# EAGLE design counter (EAGLE 5.11)
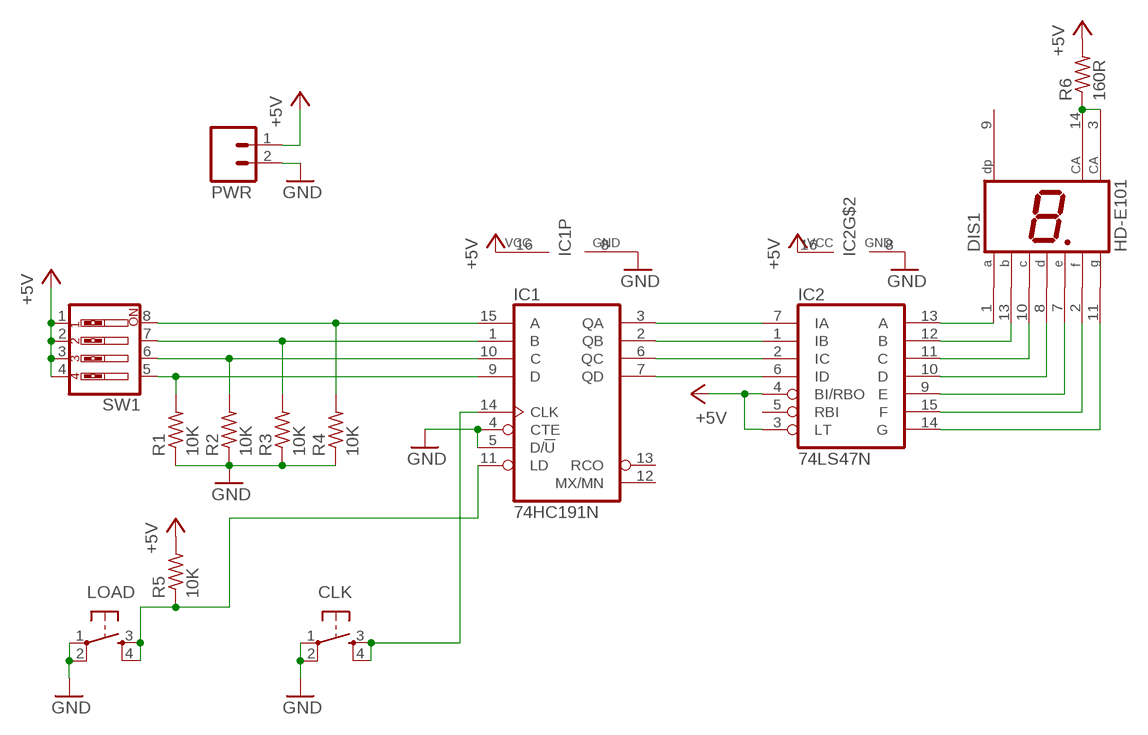
[diagram p0: schematic, sheet 1]

## Parts
CLK  TAC_SWITCHPTH  [TACTILE-PTH]
DIS1  HD-E101  [HDSP-I]
IC1  74HC191N  [DIL16]
IC2  74LS47N  [DIL16]
LOAD  TAC_SWITCHPTH  [TACTILE-PTH]
PWR  M02PTH3  [1X02_LONGPADS]
R1  10K  R-US_0204/7  [0204/7]
R2  10K  R-US_0204/7  [0204/7]
R3  10K  R-US_0204/7  [0204/7]
R4  10K  R-US_0204/7  [0204/7]
R5  10K  R-US_0204/7  [0204/7]
R6  160R  R-US_0204/7  [0204/7]
SW1  SW_DIP-4  [EDG-04]

## Nets
+5V: IC1.16(VCC) IC2.3(LT) IC2.4(BI/RBO) IC2.16(VCC) PWR.1 R5.2 R6.2 SW1.1 SW1.2 SW1.3 SW1.4
GND: CLK.1 CLK.2 IC1.4(CTE) IC1.5(D/!U) IC1.8(GND) IC2.8(GND) LOAD.1 LOAD.2 PWR.2 R1.1 R2.1 R3.1 R4.1
N$1: IC1.9(D) R1.2 SW1.5
N$2: IC1.10(C) R2.2 SW1.6
N$3: IC1.1(B) R3.2 SW1.7
N$4: IC1.15(A) R4.2 SW1.8
N$5: IC1.11(LD) LOAD.3 LOAD.4 R5.1
N$6: IC1.3(QA) IC2.7(IA)
N$7: CLK.3 CLK.4 IC1.14(CLK)
N$8: IC1.2(QB) IC2.1(IB)
N$9: IC1.6(QC) IC2.2(IC)
N$10: IC1.7(QD) IC2.6(ID)
N$11: DIS1.1(A) IC2.13(A)
N$12: DIS1.13(B) IC2.12(B)
N$13: DIS1.10(C) IC2.11(C)
N$14: DIS1.8(D) IC2.10(D)
N$15: DIS1.7(E) IC2.9(E)
N$16: DIS1.2(F) IC2.15(F)
N$17: DIS1.11(G) IC2.14(G)
N$18: DIS1.3(CA) DIS1.14(CA) R6.1
Unconnected: DIS1.9(DP) IC1.12(MX/MN) IC1.13(RCO) IC2.5(RBI)

## Library data of the parts
CLK LOAD = SparkFun:TAC_SWITCH: Momentary Switch Button commonly used for reset or general input. Spark Fun Electronics SKU : COM-00097
DIS1 = display-hp:HD-E101: LED DISPLAY 1-character 7 segment, decimal point right; OC_FARNELL: unknown; OC_NEWARK: unknown
IC1 = 74xx-eu:74*191: Synchronous UP/DOWN COUNTER
IC2 = 74xx-eu:74*47: BCD to seven segment DECODER/DRIVER Source: http://www.ee.washington.edu/stores/DataSheets/74ls/74ls47.pdf
PWR = SparkFun:M02: Header 2 Standard 2-pin 0.1" header. Use with straight break away headers (SKU : PRT-00116), right angle break away headers (PRT-00553), swiss pins (PRT-00743), machine pins (PRT-00117), and female headers (PRT-00115). Molex polarized connector foot print use with SKU : PRT-08233 with associated crimp pins and housings.
R1-R6 = adafruit:R-US_: RESISTOR, American symbol
SW1 = special:SW_DIP-4: DIP SWITCH

## Board
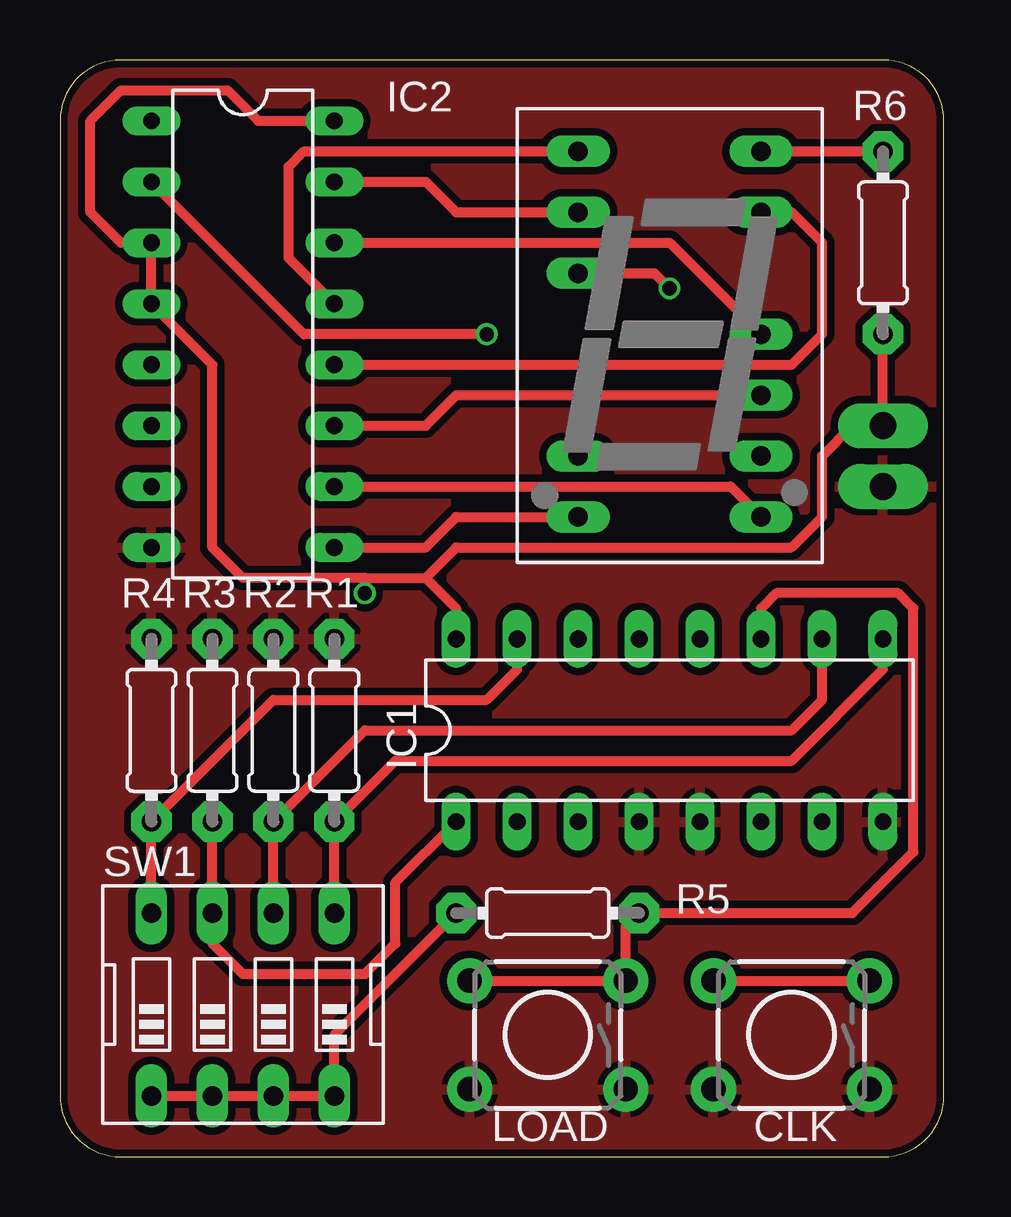
[diagram p1: board, top side]
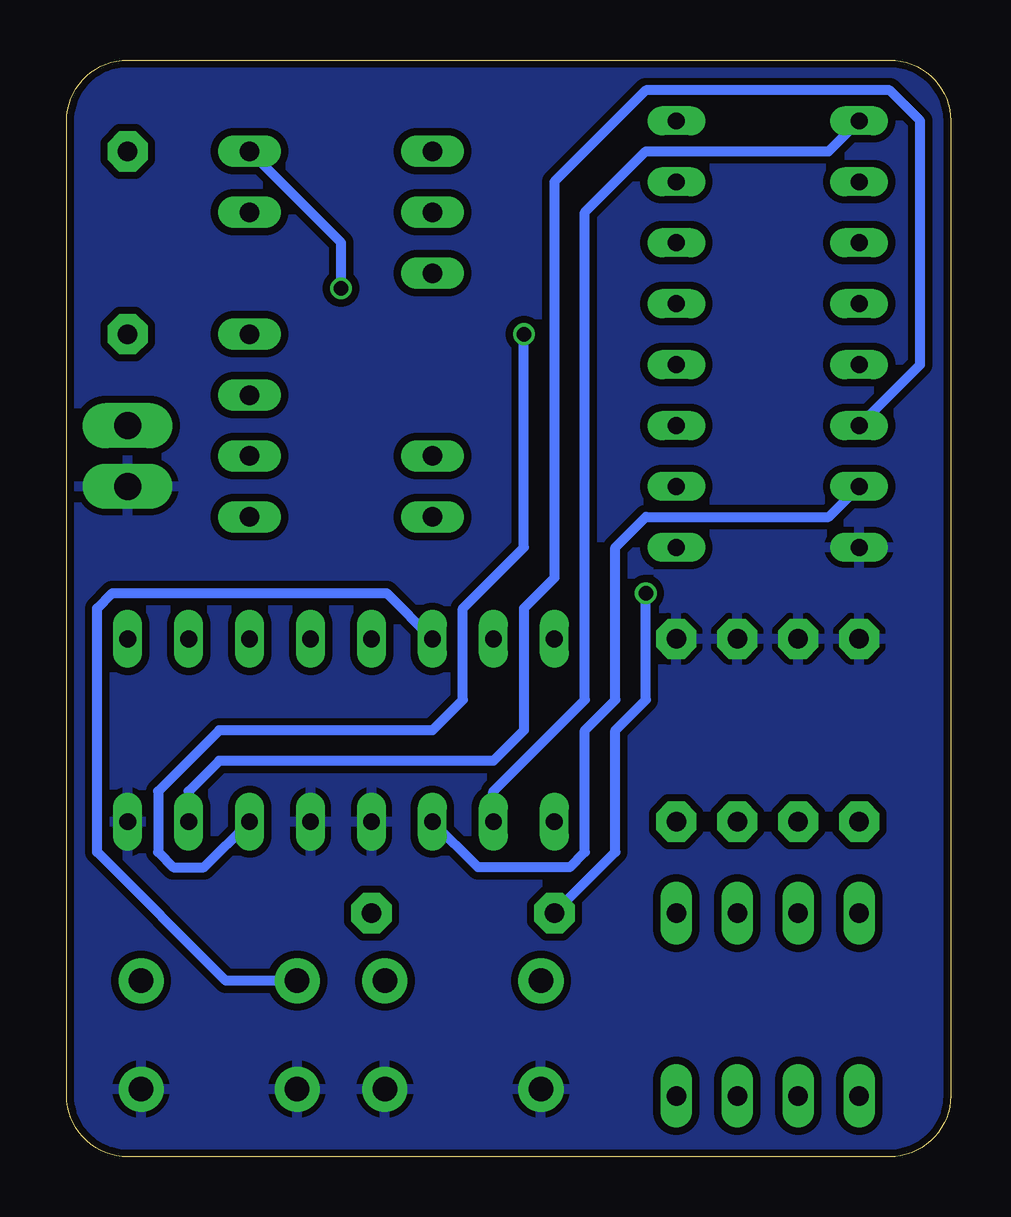
[diagram p2: board, bottom side, seen from below]

Size 36.83 x 45.72 mm. Coordinates in mm from the lower left corner, seen from the top.
Outline: 2.54,45.72 arc90 0,43.18 0,2.54 arc90 2.54,0 34.29,0 arc90 36.83,2.54 36.83,43.18 arc90 34.29,45.72 2.54,45.72
Copper layers (1*16): Top 0.035mm / dielectric 1.5mm / Bottom 0.035mm
Design rules "ITead_rule": minimum track width 8mil, minimum drill 12mil, track to track 8mil, track to pad 8mil, pad to pad 8mil, via to via 8mil, smd to smd 8mil, copper to edge 10mil, drill to drill 10mil, minimum pad ring 10mil, minimum via ring 6mil, stop-mask expansion 2mil, vias tented up to drill 100mil, thermal gap 10mil

### Footprints (pad centres in the part's own frame; a part is rotated, then mirrored left to right if it is on the bottom)
TACTILE-PTH = drill 1.016 pad 1.88 round: 1 -3.251,2.261; 2 3.251,2.261; 3 -3.251,-2.261; 4 3.251,-2.261
HDSP-I = drill 0.813 long: 1 -3.81,7.62; 2 -3.81,5.08; 3 -3.81,2.54; 6 -3.81,-5.08; 7 -3.81,-7.62; 8 3.81,-7.62; 9 3.81,-5.08; 10 3.81,-2.54; 11 3.81,0; 13 3.81,5.08; 14 3.81,7.62
DIL16 = drill 0.7 pad 1.016 long: 1 -8.89,-3.81; 2 -6.35,-3.81; 3 -3.81,-3.81; 4 -1.27,-3.81; 5 1.27,-3.81; 6 3.81,-3.81; 7 6.35,-3.81; 8 8.89,-3.81; 9 8.89,3.81; 10 6.35,3.81; 11 3.81,3.81; 12 1.27,3.81; 13 -1.27,3.81; 14 -3.81,3.81; 15 -6.35,3.81; 16 -8.89,3.81
1X02_LONGPADS = drill 1.118 pad 1.88 long: 1 0,0; 2 2.54,0
0204/7 = drill 0.813 pad 1.676 octagon: 1 -3.81,0; 2 3.81,0
EDG-04 = drill 0.813 long: 1 -3.81,-3.81; 2 -1.27,-3.81; 3 1.27,-3.81; 4 3.81,-3.81; 5 3.81,3.81; 6 1.27,3.81; 7 -1.27,3.81; 8 -3.81,3.81

### Placement (x,y rotation side)
CLK  30.48,5.08 180 top
DIS1  25.4,34.29 0 top
IC1  25.4,17.78 0 top
IC2  7.62,34.29 270 top
LOAD  20.32,5.08 180 top
PWR  34.29,30.48 270 top
R1  11.43,17.78 270 top
R2  8.89,17.78 270 top
R3  6.35,17.78 270 top
R4  3.81,17.78 270 top
R5  20.32,10.16 180 top
R6  34.29,38.1 270 top
SW1  7.62,6.35 0 top

### Tracks (layer width: path | path; a pad name or v marks a point on that pad's centre or on a via)
+5V  (via drill 0.6)
  Top 0.406: SW1.1 SW1.2 SW1.3 SW1.4 11.43,5.08 R5.2 | R6.2 PWR.1 33.02,30.48 31.75,29.21 31.75,26.67 30.48,25.4 16.51,25.4 15.24,24.13 | IC2.16 8.26,43.18 6.99,44.45 2.54,44.45 1.27,43.18 1.27,39.37 2.54,38.1 IC2.3 IC2.4 6.35,33.02 6.35,25.4 7.62,24.13 12.7,24.13 | 12.7,24.13 15.24,24.13 | IC1.16 16.51,22.86 15.24,24.13 | v12.7,23.5 12.7,24.13
  Bottom 0.406: R5.2 13.97,12.7 13.97,17.78 12.7,19.05 v12.7,23.5
GND
  pour Bottom (isolate 0.305): 0,0 36.83,0 36.83,45.72 0,45.72
  pour Top (isolate 0.305): 0,0 36.83,0 36.83,45.72 0,45.72
N$1
  Top 0.406: SW1.5 R1.2 13.97,16.51 30.48,16.51 34.29,20.32 IC1.9
N$2
  Top 0.406: SW1.6 R2.2 12.7,17.78 30.48,17.78 31.75,19.05 IC1.10
N$3
  Top 0.406: R3.2 SW1.7 6.35,8.89 7.62,7.62 12.7,7.62 13.97,8.89 13.97,11.43 IC1.1
N$4
  Top 0.406: SW1.8 R4.2 8.89,19.05 17.78,19.05 19.05,20.32 IC1.15
N$5
  Top 0.406: 23.57,7.62 LOAD.3 | 23.57,7.62 23.57,9.6 R5.1 33.02,10.16 35.56,12.7 35.56,22.86 34.92,23.5 29.84,23.5 29.21,22.86 IC1.11 | LOAD.4 23.29,7.34 23.57,7.62
N$6
  Bottom 0.406: IC2.7 5.08,26.67 12.7,26.67 13.97,25.4 13.97,19.05 15.24,17.78 15.24,12.7 15.88,12.06 19.68,12.06 IC1.3
N$7
  Top 0.406: CLK.4 CLK.3
  Bottom 0.406: CLK.4 30.2,7.34 35.56,12.7 35.56,22.86 34.92,23.5 23.5,23.5 IC1.14
N$8
  Bottom 0.406: IC1.2 19.05,15.24 15.24,19.05 15.24,39.37 12.7,41.91 5.08,41.91 IC2.1
N$9  (via drill 0.6)
  Top 0.406: v17.78,34.29 10.16,34.29 IC2.2
  Bottom 0.406: IC1.6 31.11,12.06 32.38,12.06 33.02,12.7 33.02,15.24 30.48,17.78 21.59,17.78 20.32,19.05 20.32,22.86 17.78,25.4 v17.78,34.29
N$10
  Bottom 0.406: IC1.7 31.75,15.24 30.48,16.51 19.05,16.51 17.78,17.78 17.78,22.86 16.51,24.13 16.51,40.64 12.7,44.45 2.54,44.45 1.27,43.18 1.27,33.02 IC2.6
N$11
  Top 0.406: IC2.13 9.53,37.47 9.53,41.27 10.16,41.91 DIS1.1
N$12
  Top 0.406: IC2.12 30.48,33.02 31.75,34.29 31.75,38.1 30.48,39.37 DIS1.13
N$13
  Top 0.406: IC2.11 15.24,30.48 16.51,31.75 DIS1.10
N$14
  Top 0.406: IC2.10 27.94,27.94 DIS1.8
N$15
  Top 0.406: IC2.9 15.24,25.4 16.51,26.67 DIS1.7
N$16
  Top 0.406: IC2.15 15.24,40.64 16.51,39.37 DIS1.2
N$17
  Top 0.406: IC2.14 25.4,38.1 DIS1.11
N$18  (via drill 0.6)
  Top 0.406: DIS1.14 R6.1 | DIS1.3 24.77,36.83 v25.4,36.2
  Bottom 0.406: v25.4,36.2 25.4,38.1 DIS1.14